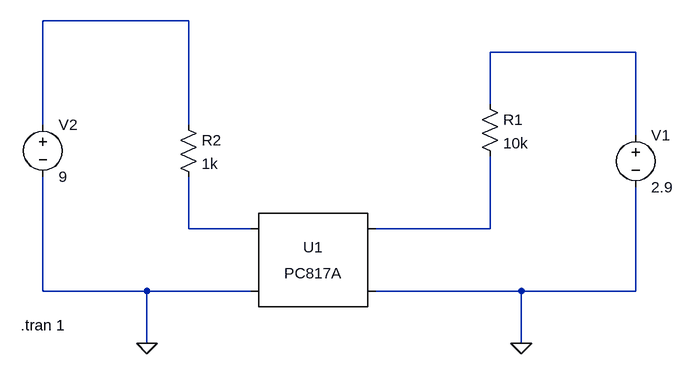
[diagram p0: schematic OptoSimulation.asc]
OptoSimulation.asc, the LTspice schematic file:
Version 4
SHEET 1 880 680
WIRE -160 -208 -384 -208
WIRE 528 -160 304 -160
WIRE 304 -80 304 -160
WIRE -384 -48 -384 -208
WIRE -160 -48 -160 -208
WIRE 528 -32 528 -160
WIRE -160 112 -160 32
WIRE -64 112 -160 112
WIRE 304 112 304 0
WIRE 304 112 128 112
WIRE -384 208 -384 32
WIRE -224 208 -384 208
WIRE -64 208 -224 208
WIRE 352 208 128 208
WIRE 528 208 528 48
WIRE 528 208 352 208
WIRE -224 288 -224 208
WIRE 352 288 352 208
FLAG -224 288 0
FLAG 352 288 0
SYMBOL Optos\\PC817A 32 160 R0
SYMATTR InstName U1
SYMBOL voltage 528 -48 R0
WINDOW 123 0 0 Left 2
WINDOW 39 0 0 Left 2
SYMATTR InstName V1
SYMATTR Value 2.9
SYMBOL res 288 -96 R0
SYMATTR InstName R1
SYMATTR Value 10k
SYMBOL voltage -384 -64 R0
WINDOW 123 0 0 Left 2
WINDOW 39 0 0 Left 2
SYMATTR InstName V2
SYMATTR Value 9
SYMBOL res -176 -64 R0
SYMATTR InstName R2
SYMATTR Value 1k
TEXT -418 260 Left 2 !.tran 1

The netlist it stands for:
* OptoSimulation.asc
XU1 N003 0 N004 0 PC817 Igain=1m
V1 N002 0 2.9
R1 N002 N004 10k
V2 N001 0 9
R2 N001 N003 1k
.tran 1
.lib PC817.sub
.backanno
.end